# EAGLE design MicroMod_Asset_Tracker_Firmware_Update_Tool (EAGLE 9.6.2)
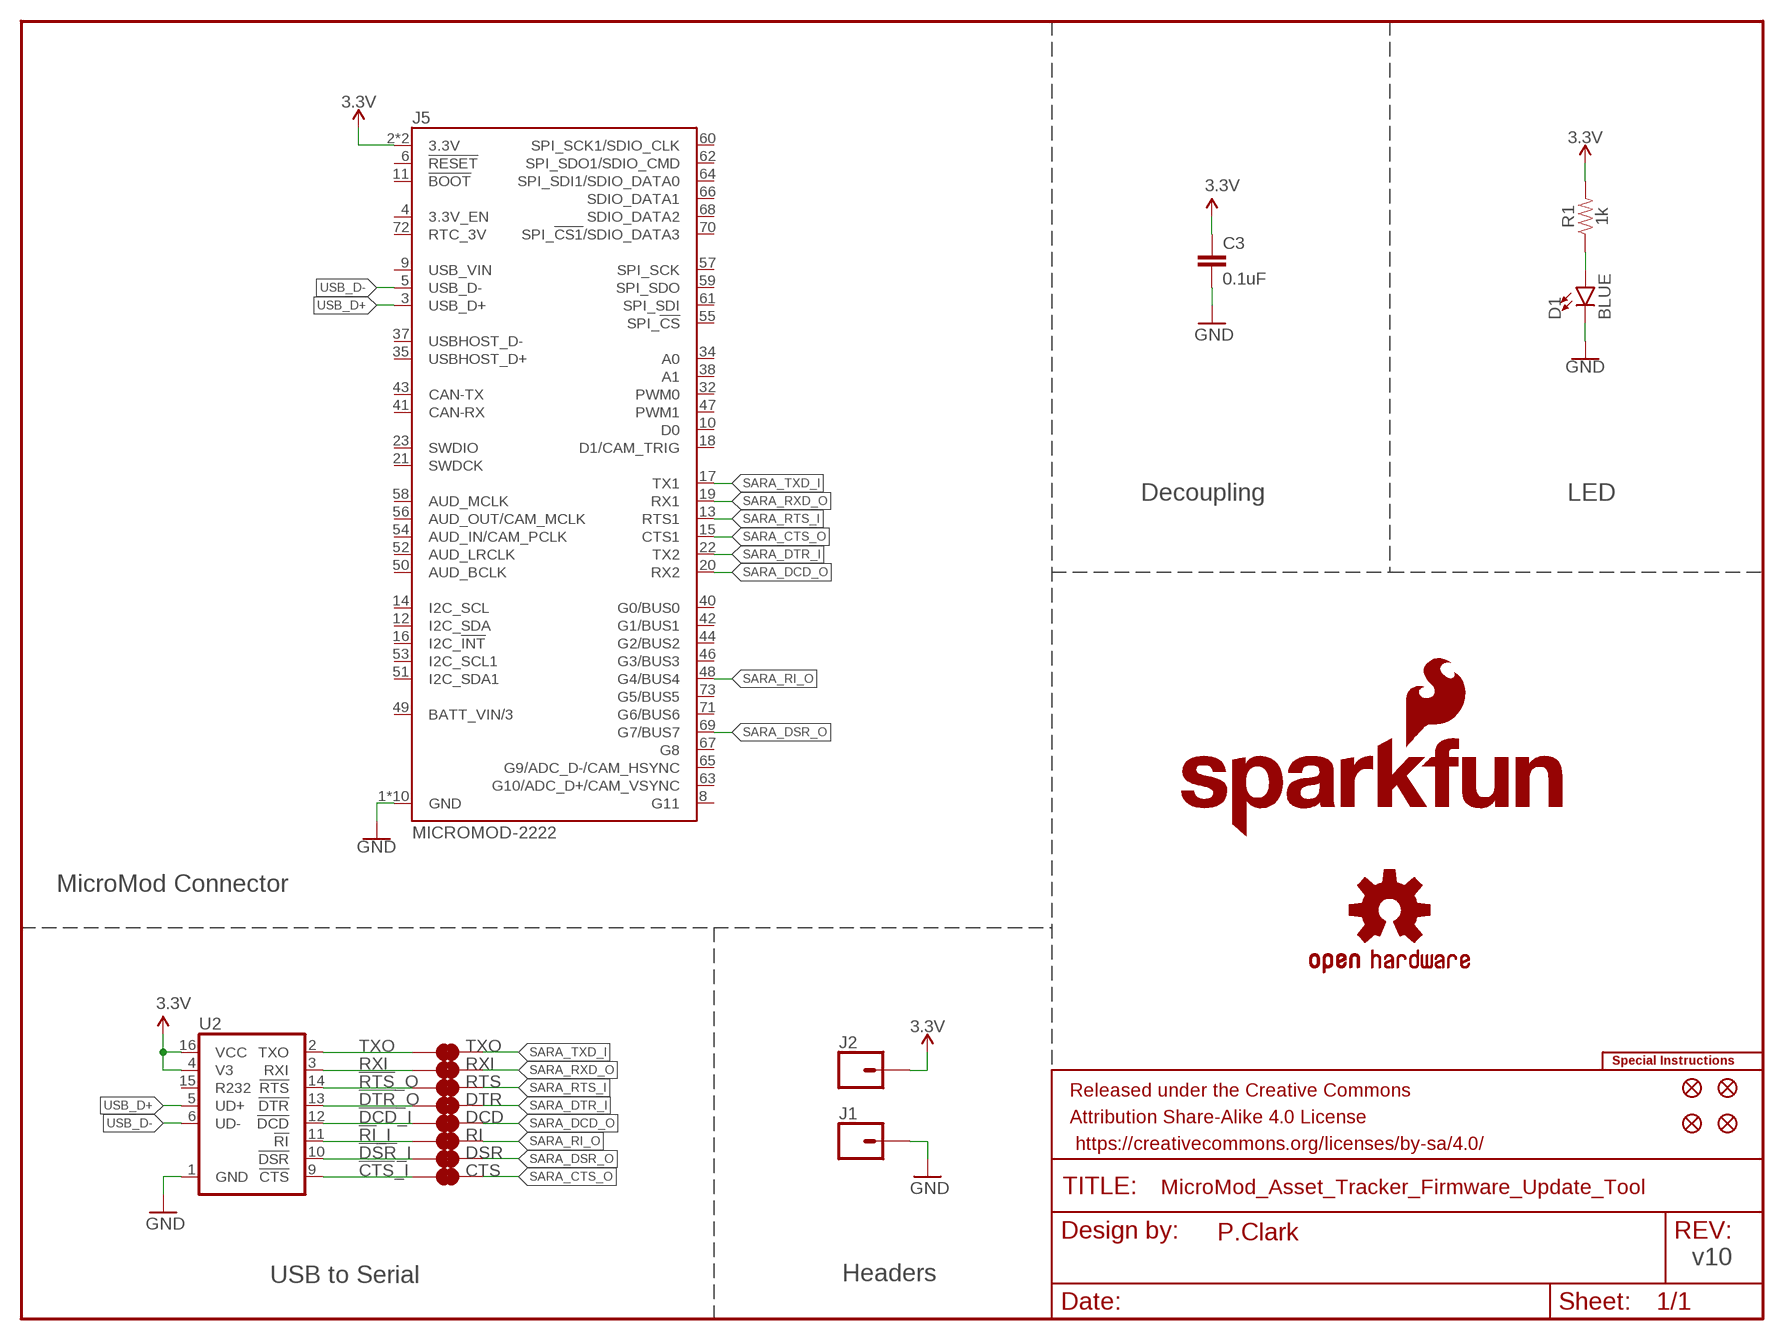
[diagram p0: schematic, sheet 1]

## Parts
C3  0.1uF  0.1UF-0603-25V-5%  [0603]
CTS  JUMPER-COMBO_2_NC_TRACE  [COMBO-JUMPER_2_NC_TRACE]
D1  BLUE  LED-BLUE0603  [LED-0603]
DCD  JUMPER-COMBO_2_NC_TRACE  [COMBO-JUMPER_2_NC_TRACE]
DSR  JUMPER-COMBO_2_NC_TRACE  [COMBO-JUMPER_2_NC_TRACE]
DTR  JUMPER-COMBO_2_NC_TRACE  [COMBO-JUMPER_2_NC_TRACE]
FRAME1  FRAME-LETTER  [CREATIVE_COMMONS]
J1  CONN_01PTH_NO_SILK_YES_STOP  [1X01_NO_SILK]
J2  CONN_01PTH_NO_SILK_YES_STOP  [1X01_NO_SILK]
J5  MICROMOD-2222  [M.2-CARD-E-22]
JP3  FIDUCIAL1X2  [FIDUCIAL-1X2]
JP4  FIDUCIAL1X2  [FIDUCIAL-1X2]
JP5  FIDUCIAL1X2  [FIDUCIAL-1X2]
JP6  FIDUCIAL1X2  [FIDUCIAL-1X2]
LOGO1  OSHW-LOGOMINI  [OSHW-LOGO-MINI]
LOGO2  SPECIAL_INSTRUCTIONS-ORDERING  [ORDERING_INSTRUCTIONS]
LOGO3  SFE_LOGO_NAME_FLAME.1_INCH  [SFE_LOGO_NAME_FLAME_.1]
R1  1k  1KOHM-0603-1/10W-1%  [0603]
RI  JUMPER-COMBO_2_NC_TRACE  [COMBO-JUMPER_2_NC_TRACE]
RTS  JUMPER-COMBO_2_NC_TRACE  [COMBO-JUMPER_2_NC_TRACE]
RXI  JUMPER-COMBO_2_NC_TRACE  [COMBO-JUMPER_2_NC_TRACE]
TXO  JUMPER-COMBO_2_NC_TRACE  [COMBO-JUMPER_2_NC_TRACE]
U2  CH340C  [SO016]

## Nets
3.3V [power]: C3.1 J2.1 J5.2(3.3V) J5.74(3.3V) R1.2 U2.4(V3) U2.16(VCC)
!CTS!_I: CTS.1 CTS.3 U2.9(!CTS)
!DCD!_I: DCD.1 DCD.3 U2.12(!DCD)
!DSR!_I: DSR.1 DSR.3 U2.10(!DSR)
!DTR!_O: DTR.1 DTR.3 U2.13(!DTR)
!RI!_I: RI.1 RI.3 U2.11(!RI)
!RTS!_O: RTS.1 RTS.3 U2.14(!RTS)
GND [power]: C3.2 D1.C J1.1 J5.1(GND) J5.7(GND) J5.33(GND) J5.36(GND) J5.39(GND) J5.45(GND) J5.75(GND) J5.GND1(GND) J5.GND2(GND) J5.GND3(GND) U2.1(GND)
N$3: D1.A R1.1
RXI: RXI.1 RXI.3 U2.3(RXI)
SARA_CTS_O: CTS.2 CTS.4 J5.15(CTS1)
SARA_DCD_O: DCD.2 DCD.4 J5.20(RX2)
SARA_DSR_O: DSR.2 DSR.4 J5.69(G7/BUS7)
SARA_DTR_I: DTR.2 DTR.4 J5.22(TX2)
SARA_RI_O: J5.48(G4/BUS4) RI.2 RI.4
SARA_RTS_I: J5.13(RTS1) RTS.2 RTS.4
SARA_RXD_O: J5.19(RX1) RXI.2 RXI.4
SARA_TXD_I: J5.17(TX1) TXO.2 TXO.4
TXO: TXO.1 TXO.3 U2.2(TXO)
USB_D+: J5.3(USB_D+) U2.5(UD+)
USB_D-: J5.5(USB_D-) U2.6(UD-)
Unconnected: J5.4(3.3V_EN) J5.6(!RESET!) J5.8(G11) J5.9(USB_VIN) J5.10(D0) J5.11(!BOOT!) J5.12(I2C_SDA) J5.14(I2C_SCL) J5.16(I2C_!INT!) J5.18(D1/CAM_TRIG) J5.21(SWDCK) J5.23(SWDIO) J5.32(PWM0) J5.34(A0) J5.35(USBHOST_D+) J5.37(USBHOST_D-) J5.38(A1) J5.40(G0/BUS0) J5.41(CAN-RX) J5.42(G1/BUS1) J5.43(CAN-TX) J5.44(G2/BUS2) J5.46(G3/BUS3) J5.47(PWM1) J5.49(BATT_VIN/3) J5.50(AUD_BCLK) J5.51(I2C_SDA1) J5.52(AUD_LRCLK) J5.53(I2C_SCL1) J5.54(AUD_IN/CAM_PCLK) J5.55(SPI_!CS!) J5.56(AUD_OUT/CAM_MCLK) J5.57(SPI_SCK) J5.58(AUD_MCLK) J5.59(SPI_SDO) J5.60(SPI_SCK1/SDIO_CLK) J5.61(SPI_SDI) J5.62(SPI_SDO1/SDIO_CMD) J5.63(G10/ADC_D+/CAM_VSYNC) J5.64(SPI_SDI1/SDIO_DATA0) J5.65(G9/ADC_D-/CAM_HSYNC) J5.66(SDIO_DATA1) J5.67(G8) J5.68(SDIO_DATA2) J5.70(SPI_!CS1!/SDIO_DATA3) J5.71(G6/BUS6) J5.72(RTC_3V) J5.73(G5/BUS5) U2.15(R232)

## Notes on the sheet
- Decoupling | LED
- MicroMod Connector
- P.Clark
- v10
- USB to Serial | Headers

## Library data of the parts
C3 = SparkFun-Capacitors:0.1UF: 0.1µF ceramic capacitors A capacitor is a passive two-terminal electrical component used to store electrical energy temporarily in an electric field.; PROD_ID: CAP-08604
CTS DCD DSR DTR RI RTS RXI TXO = SparkFun-Jumpers:JUMPER-COMBO_2_NC_TRACE
D1 = SparkFun-LED:LED-BLUE: Blue SMD LED Used in manufacturing of various products at SparkFun Packages: 0603 - SMD 0603 package [Product Link] <http://www.digikey.com/product-detail/en/SMLE12BC7TT86/511-1589-2-ND/1641808> 1206 - SMD1206 package [Product Link] <http://www.digikey.com/product-detail/en/lite-on-inc/LTST-C150TBKT/160-1643-1-ND/573584> SparkFun Products: ESP8266 Thing-Dev Board <https://www.sparkfun.com/products/13711> RedBoard <https://www.sparkfun.com/products/12757>; PROD_ID: DIO-08575
FRAME1 = SparkFun-Aesthetics:FRAME-LETTER: Schematic Frame - Letter Standard 8.5x11 US Letter frame
J1 J2 = SparkFun-Connectors:CONN_01: Single connection point. Often used as Generic Header-pin footprint for 0.1 inch spaced/style header connections On any of the 0.1 inch spaced packages, you can populate with these: Break Away Headers - Straight <https://www.sparkfun.com/products/116> (PRT-00116) Break Away Male Headers - Right Angle <https://www.sparkfun.com/products/553> (PRT-00553) Female Headers <https://www.sparkfun.com/products/115> (PRT-00115) Break Away Headers - Machine Pin <https://www.sparkfun.com/products/117> (PRT-00117) Break Away Female Headers - Swiss Machine Pin <https://www.sparkfun.com/products/743> (PRT-00743) This device is also useful as a general connection point to wire up your design to another part of your project. Our various solder wires solder well into these plated through hole pads. Hook-Up Wire - Assortment (Stranded, 22 AWG) <https://www.sparkfun.com/products/11375> (PRT-11375) Hook-Up Wire - Assortment (Solid Core, 22 AWG) <https://www.sparkfun.com/products/11367> (PRT-11367) View the entire wire category on our website here <https://www.sparkfun.com/categories/141> Special notes: SMTSO-256-ET is a "flush mount" nut for a 4-40 screw. We mostly use this on specialty testbeds; it is a nice way to connect hardware to your PCB at an adjustable hieght. Also note, the SNAP packages are for using a snappable style connector. We sell a baggie of snaps and they are also used on two LilyPad designs: Snap Assortment - 30 pack (male and female) <https://www.sparkfun.com/products/11347> (DEV-11347) LilyPad Arduino SimpleSnap <https://www.sparkfun.com/products/10941> (DEV-10941) LilyPad SimpleSnap Protoboard <https://www.sparkfun.com/products/10940> (DEV-10940)
J5 = SparkFun-MicroMod:MICROMOD: MicroMod Connector Description: A card edge connector and mating PCB connector to allow various MicroMod Processor Boards to be coupled with various carrier boards of different capabilities. Based on the M.2 standard.
JP3-JP6 = SparkFun-Aesthetics:FIDUCIAL: Fiducial Alignment Points Point-of-reference for pick-and-place machines and other optical instruments.
LOGO1 = SparkFun-Aesthetics:OSHW-LOGO: Open-Source Hardware (OSHW) Logo This logo indicates the piece of hardware it is found on incorporates a OSHW license and/or adheres to the definition of open source hardware found here: http://freedomdefined.org/OSHW
LOGO2 = SparkFun-Aesthetics:SPECIAL_INSTRUCTIONS: Special Ordering/Production Instructions Alert Symbol for special PCB ordering instructions or unique production process warnings. Ordering Instructions Production Instructions Types of information that should be added to box: Copper weight Soldermask color Silk color PCB thickness Number of layers PCB Standard: 1.6mm FR4 1 oz copper immersion silver plating red soldermask white silkscreen Types of information that should be added to box: Special wash requirements Depaneling instructions Humidification Glue curing Default text settings: 0.07 inch 9% ratio 50% line distance
LOGO3 = SparkFun-Aesthetics:SFE_LOGO_NAME_FLAME: SparkFun Font Logo w/ Flame This is the SparkFun full logo. The logo on the schematic will always be the same size; the package variant is the height of the flame part of the logo. Default layer for the logo on the board is tSilk.
R1 = SparkFun-Resistors:1KOHM: 1kΩ resistor A resistor is a passive two-terminal electrical component that implements electrical resistance as a circuit element. Resistors act to reduce current flow, and, at the same time, act to lower voltage levels within circuits. - Wikipedia; PROD_ID: RES-07856
U2 = SparkFun-IC-Comms:CH340C; PROD_ID: IC-14038

## Net classes
1 power: width 0.178 mm

## Board
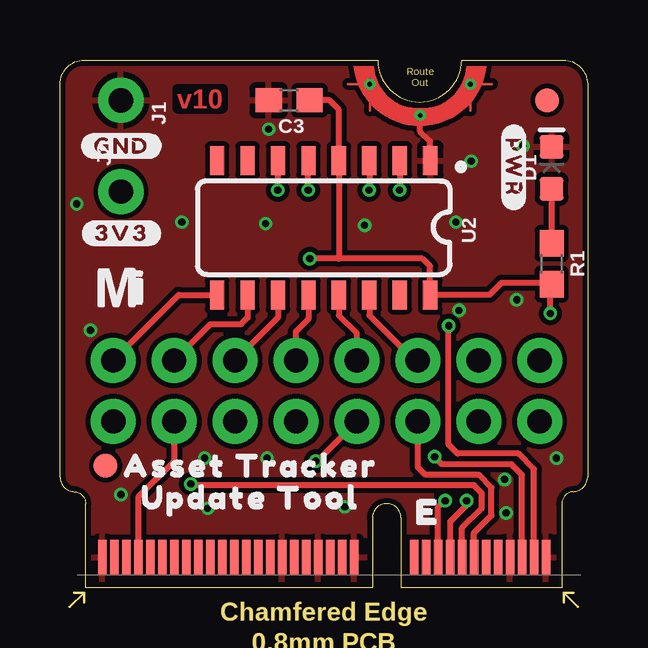
[diagram p1: board, top side]
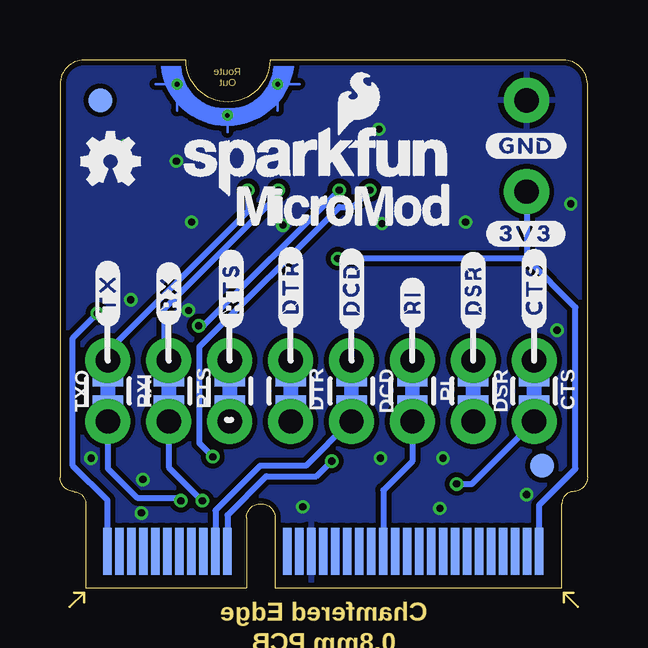
[diagram p2: board, bottom side, seen from below]

Size 22 x 22 mm. Coordinates in mm from the lower left corner, seen from the top.
Outline: 0,4.6 0,21 arc-87 1,22 13.25,22 arc180 16.75,22 21,22 arc-87 22,21 22,4.6
Outline: 0,4.6 arc87 0.6,4
Outline: 21.4,4 arc87 22,4.6
Outline: 21.4,4 arc85 20.93,3.5 20.93,0 14.22,0 14.22,2.9 arc180 13.03,2.9 13.03,0 1.07,0 1.07,3.5 arc84 0.6,4
Outline: 21.4,4 arc87 22,4.6
Outline: 0,4.6 arc87 0.6,4
Copper layers (1+2*15+16): Top 0.035mm / dielectric 0.2mm / Route2 0.0175mm / dielectric 1.065mm / Route15 0.0175mm / dielectric 0.2mm / Bottom 0.035mm
Design rules "SparkFun-4-layer-1oz-JLCPCB": minimum track width 5mil, minimum drill 0.2mm, track to track 5mil, track to pad 0.2mm, pad to pad 5mil, via to via 0.2mm, smd to smd 0mil, copper to edge 0.2mm, drill to drill 10mil, minimum pad ring 0.13mm, minimum via ring 0.13mm, stop-mask expansion 0.05mm, vias tented up to drill 25mil, thermal gap 10mil

### Footprints (pad centres in the part's own frame; a part is rotated, then mirrored left to right if it is on the bottom)
0603 = smd 1.1 x 1: 1 -0.85,0; 2 0.85,0
COMBO-JUMPER_2_NC_TRACE = smd 0.635 x 1.27: 1 -0.508,0; 2 0.508,0 | drill 1.016 pad 1.88: 3 -1.27,0; 4 1.27,0
LED-0603 = smd 1 x 1: A -0.877,0; C 0.877,0
1X01_NO_SILK = drill 1.016 pad 1.88: 1 0,0
M.2-CARD-E-22 = smd 0.35 x 1.45: 1 9.25,1.275; 3 8.75,1.275; 5 8.25,1.275; 7 7.75,1.275; 9 7.25,1.275; 11 6.75,1.275; 13 6.25,1.275; 15 5.75,1.275; 17 5.25,1.275; 19 4.75,1.275; 21 4.25,1.275; 23 3.75,1.275; 33 1.25,1.275; 35 0.75,1.275; 37 0.25,1.275; 39 -0.25,1.275; 41 -0.75,1.275; 43 -1.25,1.275; 45 -1.75,1.275; 47 -2.25,1.275; 49 -2.75,1.275; 51 -3.25,1.275; 53 -3.75,1.275; 55 -4.25,1.275; 57 -4.75,1.275; 59 -5.25,1.275; 61 -5.75,1.275; 63 -6.25,1.275; 65 -6.75,1.275; 67 -7.25,1.275; 69 -7.75,1.275; 71 -8.25,1.275; 73 -8.75,1.275; 75 -9.25,1.275 | smd 0.35 x 1.95 bottom: 2 9,1.525; 4 8.5,1.525; 6 8,1.525; 8 7.5,1.525; 10 7,1.525; 12 6.5,1.525; 14 6,1.525; 16 5.5,1.525; 18 5,1.525; 20 4.5,1.525; 22 4,1.525; 32 1.5,1.525; 34 1,1.525; 36 0.5,1.525; 38 0,1.525; 40 -0.5,1.525; 42 -1,1.525; 44 -1.5,1.525; 46 -2,1.525; 48 -2.5,1.525; 50 -3,1.525; 52 -3.5,1.525; 54 -4,1.525; 56 -4.5,1.525; 58 -5,1.525; 60 -5.5,1.525; 62 -6,1.525; 64 -6.5,1.525; 66 -7,1.525; 68 -7.5,1.525; 70 -8,1.525; 72 -8.5,1.525; 74 -9,1.525 | drill 0.2: GND1 1.9,21; GND2 4,19.7; GND3 6.1,21
FIDUCIAL-1X2 = smd 1 x 1: 1 0,0
SO016 = smd 0.6 x 1.2: 1 -4.445,-2.8; 2 -3.175,-2.8; 3 -1.905,-2.8; 4 -0.635,-2.8; 5 0.635,-2.8; 6 1.905,-2.8; 7 3.175,-2.8; 8 4.445,-2.8; 9 4.445,2.8; 10 3.175,2.8; 11 1.905,2.8; 12 0.635,2.8; 13 -0.635,2.8; 14 -1.905,2.8; 15 -3.175,2.8; 16 -4.445,2.8

### Placement (x,y rotation side)
C3  9.56,20.32 180 top
CTS  2.22,8.2 270 bottom
D1  20.5,17.5 90 top
DCD  9.84,8.2 270 bottom
DSR  4.76,8.2 270 bottom
DTR  12.38,8.2 270 bottom
FRAME1  45.03,-15.24 0 top  (outside the outline)
J1  2.54,20.32 270 top
J2  2.54,16.51 270 top
J5  11.02,-0.01 0 top
JP3  1.91,5.08 0 top
JP4  20.32,20.32 0 top
JP5  20.32,20.32 0 bottom
JP6  1.91,5.08 0 bottom
LOGO1  19.89,17.78 0 bottom
LOGO2  27.94,44.45 0 top  (outside the outline)
LOGO3  11.27,17.78 0 bottom
R1  20.5,13.5 270 top
RI  7.3,8.2 270 bottom
RTS  14.92,8.2 270 bottom
RXI  17.46,8.2 270 bottom
TXO  20,8.2 270 bottom
U2  11,15 180 top
U$1  [#TX#0]  20,12.26 90 bottom
U$2  [#RX#0]  17.46,12.26 90 bottom
U$3  [#GND#2]  2.56,18.41 0 top
U$4  [#DTR#0]  12.38,12.51 90 bottom
U$5  [#RI#0]  7.3,11.87 90 bottom
U$6  [#3V3#3]  2.58,14.76 0 bottom
U$7  [#GND#2]  2.56,18.41 0 bottom
U$8  [#PWR#0]  18.92,17.53 270 top
U$9  [MICROMOD_MI_LOGO_.35]  2.49,12.52 0 top
U$10  [ASSET_TRACKER0]  7.95,5.08 0 top
U$11  [UPDATE_TOOL0]  7.94,3.75 0 top
U$12  [MICROMOD_LOGO_.35]  10.24,15.91 0 bottom
U$14  [#CTS#0]  2.22,12.45 90 bottom
U$17  [#3V3#3]  2.57,14.77 0 top
U$18  [#DSR#0]  4.76,12.39 90 bottom
U$20  [#RTS#0]  14.86,12.45 90 bottom
U$23  [#DCD#0]  9.84,12.45 90 bottom

### Tracks (layer width: path | path; a pad name or v marks a point on that pad's centre or on a via)
3.3V  (via drill 0.3)
  Top 0.254: v20.45,11.43 20.45,12.6 R1.2 20.45,12.7 18.41,12.7 17.91,12.2 U2.16 15.43,12.21 15.43,13.4 15.11,13.72 11.62,13.72 | 11.62,13.72 v10.41,13.72 | 11.62,13.72 11.63,13.73 U2.4 11.63,19.93 11.24,20.32 C3.1
  Bottom 0.254: J5.2 20.02,3.64 21.46,5.08 21.46,10.41 v20.45,11.43 | J5.74 2.02,3.44 0.51,4.95 0.51,11.68 2.54,13.72 | 2.54,13.72 v10.41,13.72 | J2.1 2.54,13.72
!CTS!_I
  Top 0.254: U2.9 4.96,12.2 CTS.3
  Bottom 0.254: CTS.3 CTS.1
!DCD!_I
  Top 0.254: DCD.3 9.84,10.67 10.36,11.19 U2.12
  Bottom 0.254: DCD.3 DCD.1
!DSR!_I
  Top 0.254: DSR.3 6.28,10.99 7.56,10.99 7.82,11.25 U2.10
  Bottom 0.254: DSR.3 DSR.1
!DTR!_O
  Top 0.254: DTR.3 12.38,10.6 11.63,11.35 U2.13
  Bottom 0.254: DTR.3 DTR.1
!RI!_I
  Top 0.254: U2.11 9.09,11.25 RI.3
  Bottom 0.254: RI.3 RI.1
!RTS!_O
  Top 0.254: RTS.3 14.79,9.47 12.9,11.35 U2.14
  Bottom 0.254: RTS.3 RTS.1
GND  (via drill 0.3)
  Top 0.254: U2.1 15.43,17.81 15.43,18.61 15.02,19.02 J5.GND2
  other vias: 19.3,18.41 1.27,10.73 17.14,17.78 8.57,15.18 2.54,3.87 6.16,3.3 11.87,3.37 20.7,5.4 18.61,3.11 0.7,16 5.08,15.24 16.51,15.24 19.05,12 6.03,5.4 8.64,5.4 18.54,4.51 8.7,19.11 16.64,11.56 12.7,15.11
  pour Top (isolate 0.203): 0,0 0,22 22,22 22,0
  pour Bottom (isolate 0.203): 0,0 0,22 22,22 22,0
N$3
  Top 0.254: R1.1 D1.A
RXI  (via drill 0.3)
  Top 0.254: U2.3 12.9,16.59 v12.89,16.57
  Bottom 0.254: v12.89,16.57 12.89,16.38 17.65,11.62 17.65,9.66 RXI.3 RXI.1
SARA_CTS_O  (via drill 0.3)
  Top 0.254: J5.15 16.77,2.48 17.59,3.3 17.59,3.94 17.26,4.26 5.51,4.26 v5.46,4.32
  Bottom 0.254: v5.46,4.32 4.83,4.32 CTS.4 CTS.2
SARA_DCD_O
  Bottom 0.254: J5.20 15.52,3.21 13.65,5.08 11.75,5.08 9.9,6.93 DCD.4 DCD.2
SARA_DSR_O
  Top 0.254: DSR.4 4.76,5.27 3.27,3.78 J5.69
  Bottom 0.254: DSR.4 DSR.2
SARA_DTR_I  (via drill 0.3)
  Top 0.254: DTR.4 10.73,5.27 v10.67,5.27
  Bottom 0.254: v10.67,5.27 11.3,4.64 13.4,4.64 15.02,3.01 J5.22 | DTR.4 DTR.2
SARA_RI_O
  Bottom 0.254: J5.48 8.52,4.05 7.3,5.27 RI.4 RI.2
SARA_RTS_I
  Top 0.254: J5.13 17.27,2.28 18,3.01 18,4.17 17.46,4.7 15.24,4.7 14.92,5.02 RTS.4
  Bottom 0.254: RTS.4 RTS.2
SARA_RXD_O  (via drill 0.3)
  Top 0.254: v16.07,3.62 16.03,3.62 15.77,3.36 J5.19
  Bottom 0.254: v16.07,3.62 17.46,5.02 RXI.4 RXI.2
SARA_TXD_I  (via drill 0.3)
  Top 0.254: v16.95,3.62 16.95,3.43 16.27,2.74 J5.17
  Bottom 0.254: v16.95,3.62 17.08,3.75 18.79,3.75 20,4.96 TXO.4 TXO.2
TXO  (via drill 0.3)
  Top 0.254: U2.2 14.17,16.59 v14.16,16.57
  Bottom 0.254: v14.16,16.57 14.16,15.69 20,9.85 TXO.3 TXO.1
USB_D+  (via drill 0.3)
  Top 0.254: J5.3 19.77,4.93 19.11,5.59 16.57,5.59 16.19,5.97 16.19,10.9 v16.21,10.92 | U2.5 v10.35,16.57
  Bottom 0.254: v16.21,10.92 16.01,10.92 v10.35,16.57
USB_D-  (via drill 0.3)
  Top 0.254: J5.5 19.27,4.69 18.83,5.14 15.93,5.14 v15.62,5.45 | U2.6 9.08,17.79 v9.08,16.57
  Bottom 0.254: v15.62,5.45 16.19,6.02 16.19,10.03 10.35,15.88 9.78,15.88 v9.08,16.57

### Text on the board
Top: v10
tDocu: 2-Layer PCB / 0.8mm Thickness / Exposed Edge / Gold Fingers / 45° Finger Chamfered / ENIG Finish | P. Clark